# EAGLE design GPIO (EAGLE 8.7.1)
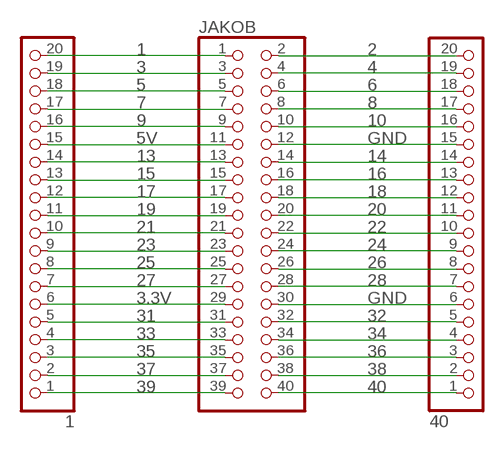
[diagram p0: schematic, sheet 1]

## Parts
1  PINHD-1X20  [1X20]
40  PINHD-1X20  [1X20]
JAKOB  PINHD-2X20  [2X20]

## Nets
1: 1.20 JAKOB.1
2: 40.20 JAKOB.2
3: 1.19 JAKOB.3
3.3V: 1.6 JAKOB.29
4: 40.19 JAKOB.4
5: 1.18 JAKOB.5
5V: 1.15 JAKOB.11
6: 40.18 JAKOB.6
7: 1.17 JAKOB.7
8: 40.17 JAKOB.8
9: 1.16 JAKOB.9
10: 40.16 JAKOB.10
13: 1.14 JAKOB.13
14: 40.14 JAKOB.14
15: 1.13 JAKOB.15
16: 40.13 JAKOB.16
17: 1.12 JAKOB.17
18: 40.12 JAKOB.18
19: 1.11 JAKOB.19
20: 40.11 JAKOB.20
21: 1.10 JAKOB.21
22: 40.10 JAKOB.22
23: 1.9 JAKOB.23
24: 40.9 JAKOB.24
25: 1.8 JAKOB.25
26: 40.8 JAKOB.26
27: 1.7 JAKOB.27
28: 40.7 JAKOB.28
31: 1.5 JAKOB.31
32: 40.5 JAKOB.32
33: 1.4 JAKOB.33
34: 40.4 JAKOB.34
35: 1.3 JAKOB.35
36: 40.3 JAKOB.36
37: 1.2 JAKOB.37
38: 40.2 JAKOB.38
39: 1.1 JAKOB.39
40: 40.1 JAKOB.40
GND: 40.6 40.15 JAKOB.12 JAKOB.30

## Library data of the parts
1 40 = pinhead:PINHD-1X20: PIN HEADER
JAKOB = pinhead:PINHD-2X20: PIN HEADER

## Board
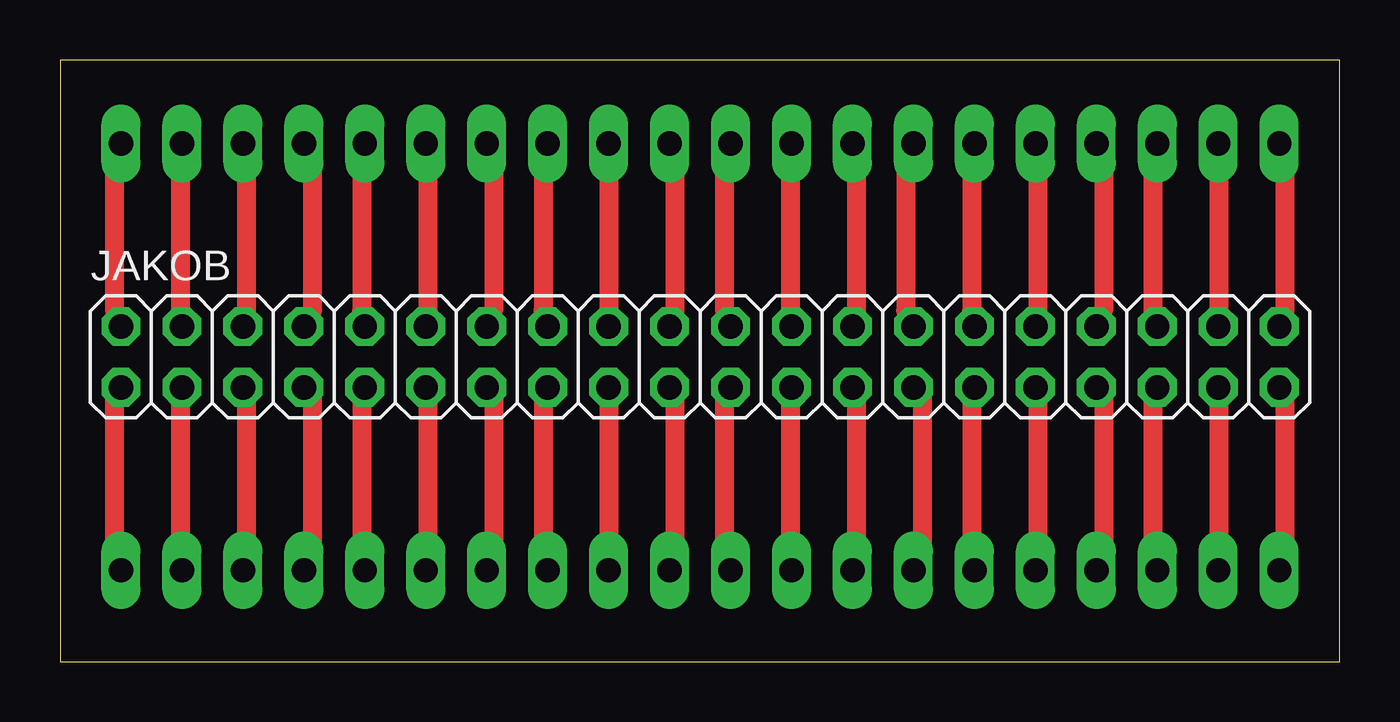
[diagram p1: board, top side]
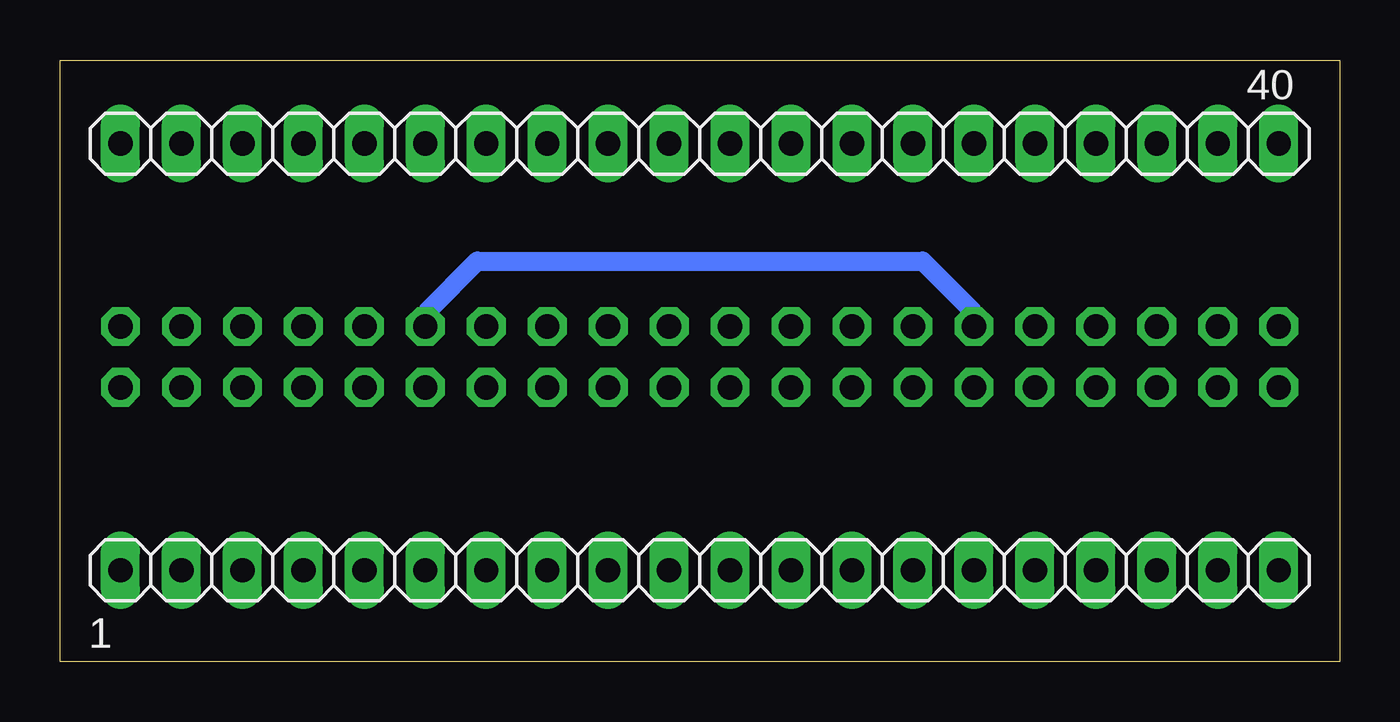
[diagram p2: board, bottom side, seen from below]

Size 53.32 x 25.07 mm. Coordinates in mm from the lower left corner, seen from the top.
Outline: 0,0 53.32,0 53.32,25.07 0,25.07 0,0
Copper layers 1+16: Top 0.018mm / dielectric 1.55mm / Bottom 0.035mm
Design rules "engn3055.2018.spring.EagleDrcFile *": minimum track width 31.25mil, minimum drill 62.5mil, track to track 0.58mm, track to pad 0.58mm, pad to pad 0.58mm, via to via 0.58mm, smd to smd 0mil, copper to edge 1mil, drill to drill 1mil, minimum pad ring 0.3mm, minimum via ring 0.3mm, stop-mask expansion 0mil, vias tented up to drill 0.45mm, thermal gap 0.2mm

### Footprints (pad centres in the part's own frame; a part is rotated, then mirrored left to right if it is on the bottom)
1X20 = drill 1.016 long: 1 -24.13,0; 2 -21.59,0; 3 -19.05,0; 4 -16.51,0; 5 -13.97,0; 6 -11.43,0; 7 -8.89,0; 8 -6.35,0; 9 -3.81,0; 10 -1.27,0; 11 1.27,0; 12 3.81,0; 13 6.35,0; 14 8.89,0; 15 11.43,0; 16 13.97,0; 17 16.51,0; 18 19.05,0; 19 21.59,0; 20 24.13,0
2X20 = drill 1.016 octagon: 1 -24.13,-1.27; 2 -24.13,1.27; 3 -21.59,-1.27; 4 -21.59,1.27; 5 -19.05,-1.27; 6 -19.05,1.27; 7 -16.51,-1.27; 8 -16.51,1.27; 9 -13.97,-1.27; 10 -13.97,1.27; 11 -11.43,-1.27; 12 -11.43,1.27; 13 -8.89,-1.27; 14 -8.89,1.27; 15 -6.35,-1.27; 16 -6.35,1.27; 17 -3.81,-1.27; 18 -3.81,1.27; 19 -1.27,-1.27; 20 -1.27,1.27; 21 1.27,-1.27; 22 1.27,1.27; 23 3.81,-1.27; 24 3.81,1.27; 25 6.35,-1.27; 26 6.35,1.27; 27 8.89,-1.27; 28 8.89,1.27; 29 11.43,-1.27; 30 11.43,1.27; 31 13.97,-1.27; 32 13.97,1.27; 33 16.51,-1.27; 34 16.51,1.27; 35 19.05,-1.27; 36 19.05,1.27; 37 21.59,-1.27; 38 21.59,1.27; 39 24.13,-1.27; 40 24.13,1.27

### Placement (x,y rotation side)
1  26.67,3.81 0 bottom
40  26.67,21.59 0 bottom
JAKOB  26.67,12.7 0 top

### Tracks (layer width: path | path; a pad name or v marks a point on that pad's centre or on a via)
1
  Top 0.794: 1.20 2.27,4.33 2.27,11.2 JAKOB.1
2
  Top 0.794: JAKOB.2 2.27,14.63 2.27,21.5 40.20
3
  Top 0.794: 1.19 5.02,4.33 5.02,11.2 JAKOB.3
3.3V
  Top 0.794: 1.6 37.99,4.33 37.99,11.2 JAKOB.29
4
  Top 0.794: JAKOB.4 5.02,14.63 5.02,21.5 40.19
5
  Top 0.794: 1.18 7.76,4.33 7.76,11.2 JAKOB.5
5V
  Top 0.794: 1.15 15.32,4.33 15.32,11.2 JAKOB.11
6
  Top 0.794: JAKOB.6 7.76,14.63 7.76,21.5 40.18
7
  Top 0.794: 1.17 10.51,4.33 10.51,11.2 JAKOB.7
8
  Top 0.794: JAKOB.8 10.51,14.63 10.51,21.5 40.17
9
  Top 0.794: 1.16 12.57,4.33 12.57,11.2 JAKOB.9
10
  Top 0.794: JAKOB.10 12.57,14.63 12.57,21.5 40.16
13
  Top 0.794: 1.14 18.07,4.33 18.07,11.2 JAKOB.13
14
  Top 0.794: JAKOB.14 18.07,14.63 18.07,21.5 40.14
15
  Top 0.794: 1.13 20.13,4.33 20.13,11.2 JAKOB.15
16
  Top 0.794: JAKOB.16 20.13,14.63 20.13,21.5 40.13
17
  Top 0.794: 1.12 22.87,4.33 22.87,11.2 JAKOB.17
18
  Top 0.794: JAKOB.18 22.87,14.63 22.87,21.5 40.12
19
  Top 0.794: 1.11 25.62,4.33 25.62,11.2 JAKOB.19
20
  Top 0.794: JAKOB.20 25.62,14.63 25.62,21.5 40.11
21
  Top 0.794: 1.10 27.68,4.33 27.68,11.2 JAKOB.21
22
  Top 0.794: JAKOB.22 27.68,14.63 27.68,21.5 40.10
23
  Top 0.794: 1.9 30.43,4.33 30.43,11.2 JAKOB.23
24
  Top 0.794: JAKOB.24 30.43,14.63 30.43,21.5 40.9
25
  Top 0.794: 1.8 33.18,4.33 33.18,11.2 JAKOB.25
26
  Top 0.794: JAKOB.26 33.18,14.63 33.18,21.5 40.8
27
  Top 0.794: 1.7 35.93,4.33 35.93,11.2 JAKOB.27
28
  Top 0.794: JAKOB.28 35.24,14.63 35.24,21.5 40.7
31
  Top 0.794: 1.5 40.73,4.33 40.73,11.2 JAKOB.31
32
  Top 0.794: JAKOB.32 40.73,14.63 40.73,21.5 40.5
33
  Top 0.794: 1.4 43.48,4.33 43.48,11.2 JAKOB.33
34
  Top 0.794: JAKOB.34 43.48,14.63 43.48,21.5 40.4
35
  Top 0.794: 1.3 45.54,4.33 45.54,11.2 JAKOB.35
36
  Top 0.794: JAKOB.36 45.54,14.63 45.54,21.5 40.3
37
  Top 0.794: 1.2 48.29,4.33 48.29,11.2 JAKOB.37
38
  Top 0.794: JAKOB.38 48.29,14.63 48.29,21.5 40.2
39
  Top 0.794: 1.1 51.04,4.33 51.04,11.2 JAKOB.39
40
  Top 0.794: JAKOB.40 51.04,14.63 51.04,21.5 40.1
GND
  Top 0.794: JAKOB.12 15.32,14.63 15.32,21.5 40.15 | JAKOB.30 37.99,14.63 37.99,21.5 40.6
  Bottom 0.794: JAKOB.12 15.32,14.63 17.38,16.69 35.93,16.69 37.99,14.63 JAKOB.30